# EasyEDA Pro project Photodetector_v2.eprj

# Schematic Schematic1
Board Name: Board1; Create Date: 2025-05-13; Page Name: P1; Project Name: Photodetector_v2; Schematic Name: Schematic1; Update Date: 2025-05-30; Company: EasyEDA.com; Page Size: A4; Version: V1.0
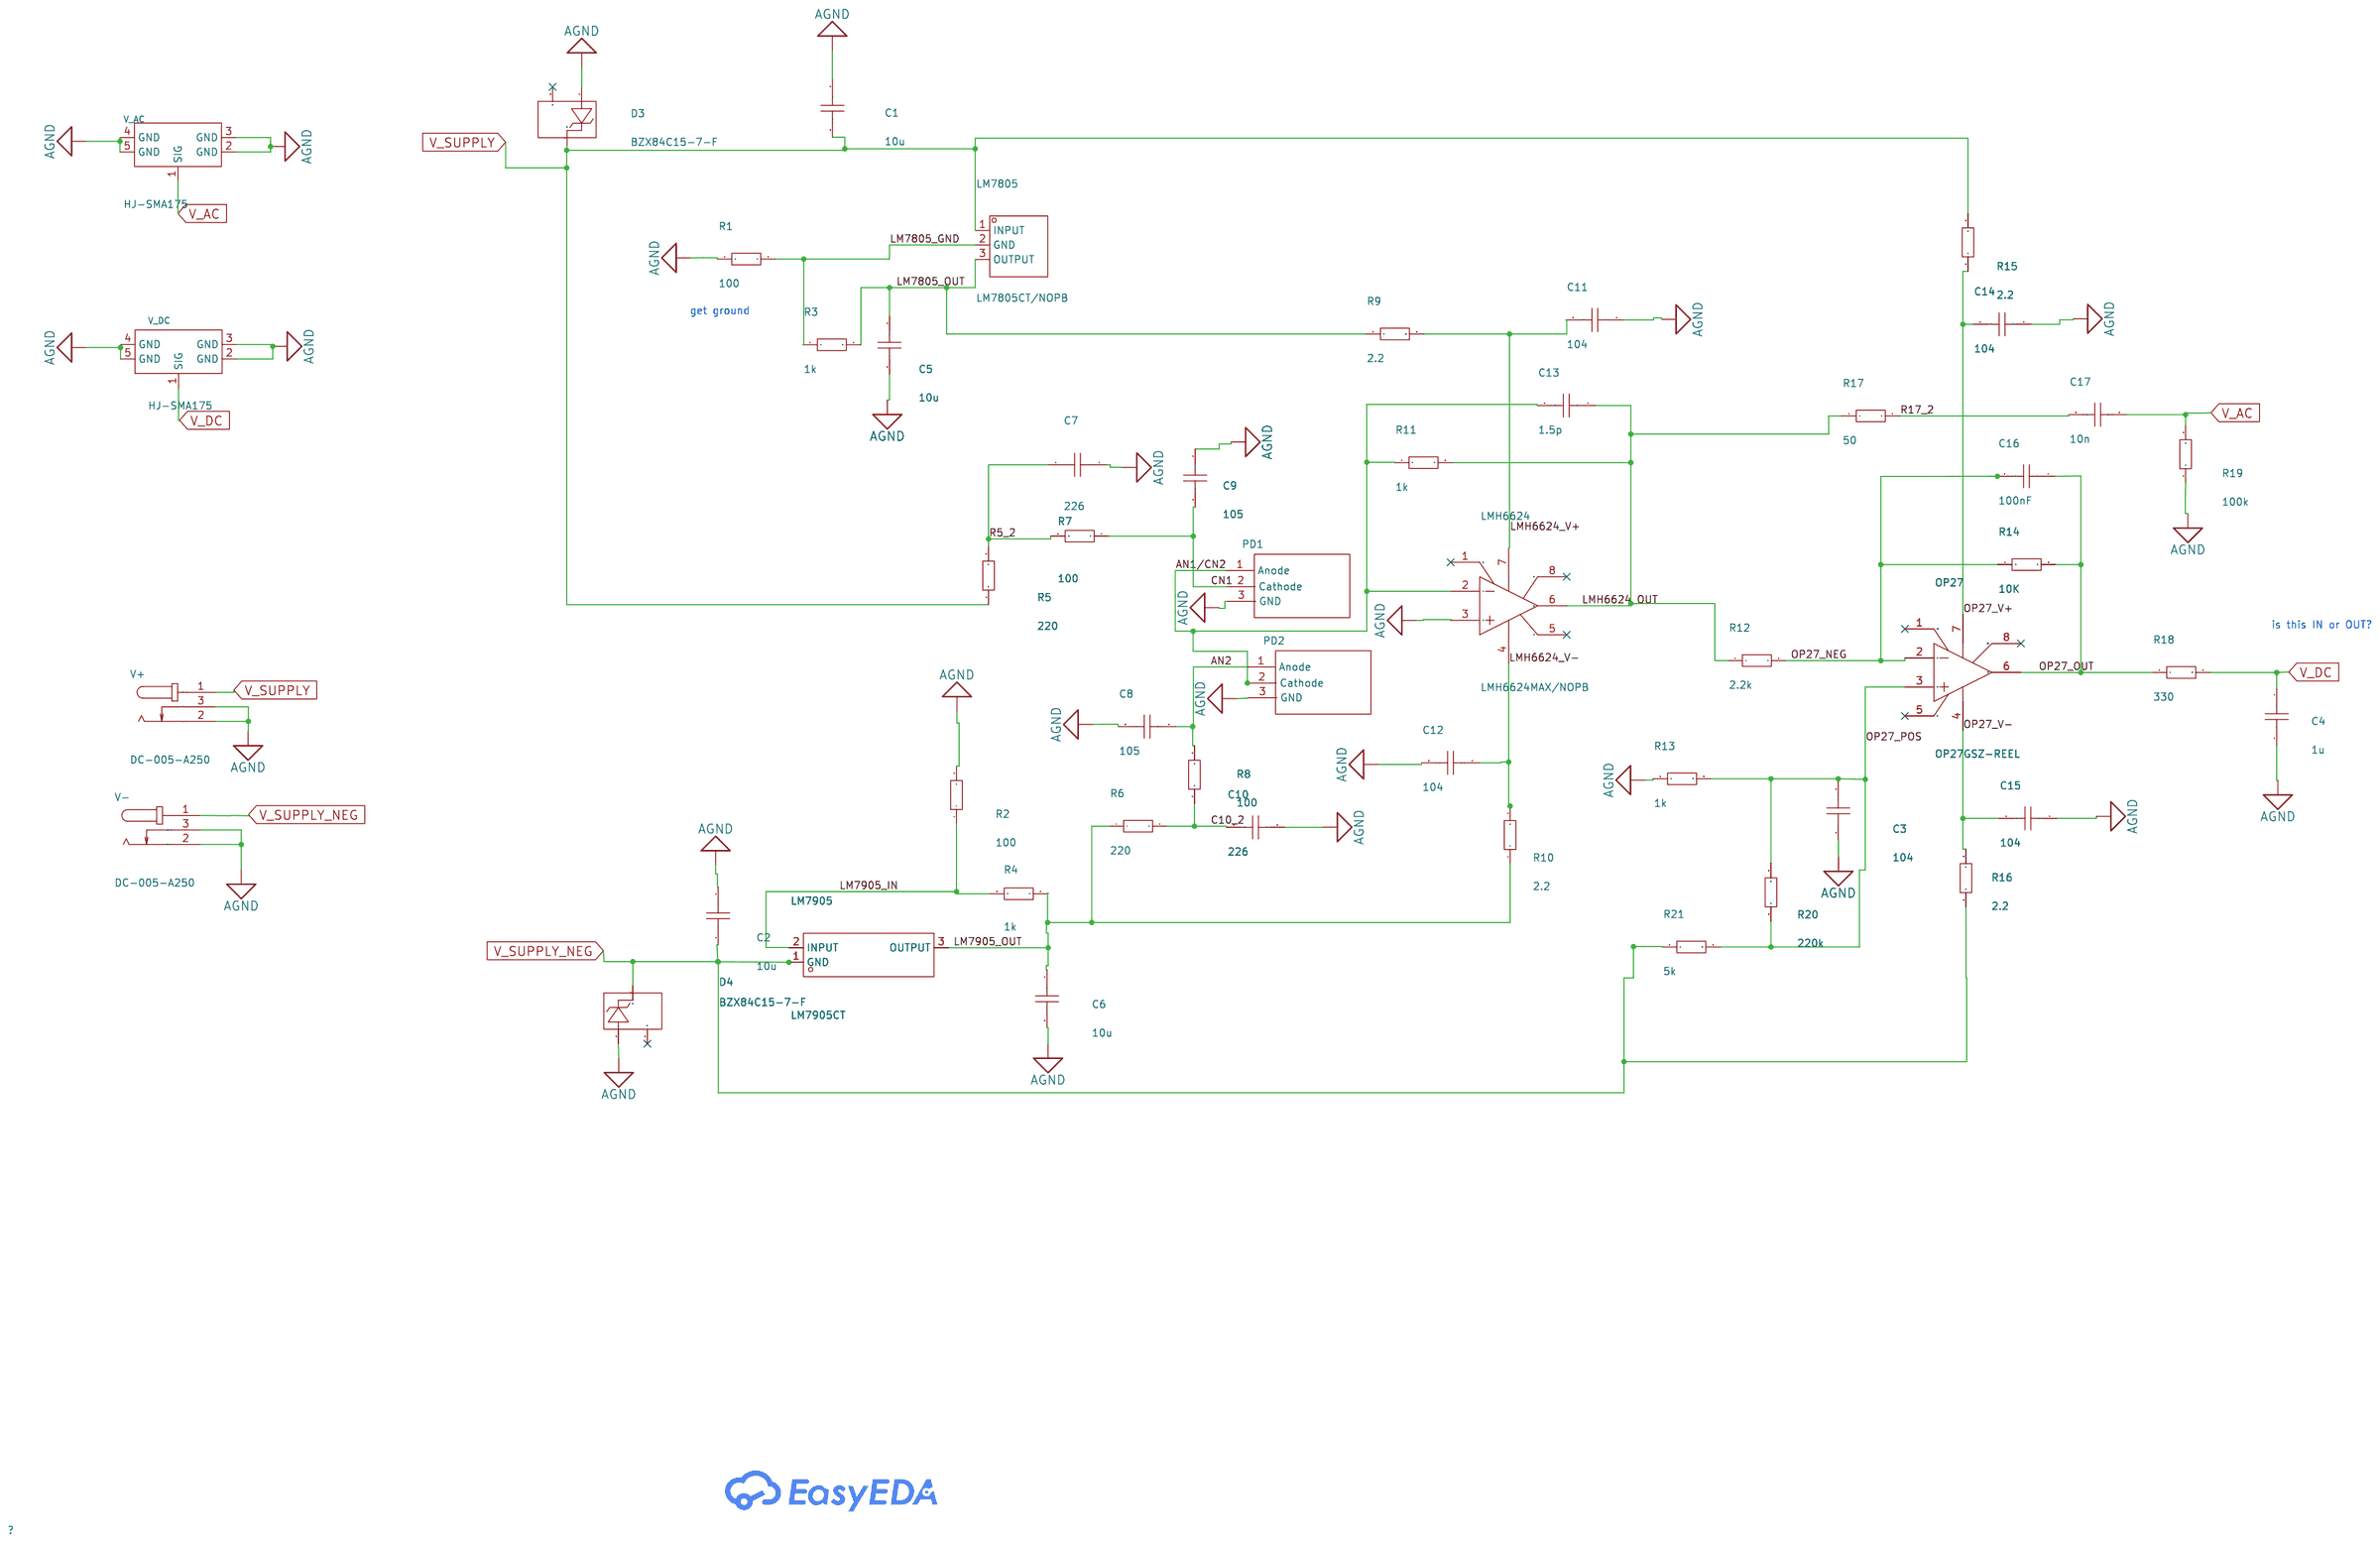
[diagram p0: schematic sheet]

## Parts
C1  10u  [C0603]
C2  10u  [C0603]
C3  104  [C0603]
C4  1u  [C0603]
C5  10u  [C0603]
C6  10u  [C0603]
C7  226  [C0603]
C8  105  [C0603]
C9  105  [C0603]
C10  226  [C0603]
C11  104  [C0603]
C12  104  [C0603]
C13  1.5p  [C0603]
C14  104  [C0603]
C15  104  [C0603]
C16  100nF  [C0603]
C17  10n  [C0603]
D3  BZX84C15-7-F  [SOT-23-3_L2.9-W1.3-P1.90-LS2.4-BR]
D4  BZX84C15-7-F  [SOT-23-3_L2.9-W1.3-P1.90-LS2.4-BR]
LM7805  LM7805CT/NOPB  [TO-220-3_L10.0-W4.5-P2.54-T]
LM7905  LM7905CT  [TO-220-3_L9.9-W4.5-P2.54-L]
LMH6624  LMH6624MAX/NOPB  [SOIC-8_L4.9-W3.9-P1.27-LS6.0-BL]
OP27  OP27GSZ-REEL  [SOIC-8_L4.9-W3.9-P1.27-LS6.0-BL]
PD1  -  [HQE Detector]
PD2  -  [HQE Detector]
R1  100  [R0603]
R2  100  [R0603]
R3  1k  [R0603]
R4  1k  [R0603]
R5  220  [R0603]
R6  220  [R0603]
R7  100  [R0603]
R8  100  [R0603]
R9  2.2  [R0603]
R10  2.2  [R0603]
R11  1k  [R0603]
R12  2.2k  [R0603]
R13  1k  [R0603]
R14  10K  [R0603]
R15  2.2  [R0603]
R16  2.2  [R0603]
R17  50  [R0603]
R18  330  [R0603]
R19  100k  [R0603]
R20  220k  [R0603]
R21  5k  [R0603]
V+  DC-005-A250  [DC-IN-TH_DC-005-A250]
V-  DC-005-A250  [DC-IN-TH_DC-005-A250]
V_AC  HJ-SMA175  [SMA-TH_HJ-SMA175]
V_DC  HJ-SMA175  [SMA-TH_HJ-SMA175]

## Library data of the parts
C1-C17 = CAP_0603: Supplier Footprint: 0603
D3 D4 = BZX84C15-7-F: Supplier Part: C500789; Manufacturer: DIODES(美台); Supplier Footprint: SOT-23; JLCPCB Part Class: Extended Part; Datasheet: https://atta.szlcsc.com/upload/public/pdf/source/20191127/C460825_8B7CE8DA99B73E2871EF5DDF3D9CE9A8.pdf; Supplier: LCSC; Diode Configuration: Single; Zener Voltage (Nom): 15V; Reverse Leakage Current (Ir): 100nA@10.5V; Zener Voltage (Range): 13.8V~15.6V; Power Dissipation: 300mW; Zener Impedance (Zzt): 30Ω; Tolerance: ±6%
LM7805 = LM7805CT/NOPB: LCSC Part Name: 1.5A、30V 线性稳压器; Supplier Part: C50931; Manufacturer: TI(德州仪器); Supplier Footprint: TO-220; JLCPCB Part Class: Extended Part; Datasheet: https://www.ti.com/cn/lit/gpn/lm7800; Supplier: LCSC; Output Type: Fixed; Maximum Input Voltage: 35V; Output Voltage: 5V; Output Current: 1A; Power Supply Rejection Ratio (PSRR): 80dB@(120Hz); Dropout Voltage: 2V@(1A); standby current: 6mA; Feature: 防静电保护；Short-Circuit  Protection；Thermal Protection(TSD)；Overcurrent Protection(OCP)；带使能; Operating Temperature: 0℃~+125℃; Output Polarity: Positive electrode; Number of Outputs: 1
LM7905 = LM7905CT_C7432217: Supplier Part: C7432217; Manufacturer: HGSEMI(华冠); Supplier Footprint: TO-220-3; JLCPCB Part Class: Extended Part; Datasheet: https://atta.szlcsc.com/upload/public/pdf/source/20231018/5BB71A5A92E7CAA6C954476BD60B4068.pdf; Supplier: LCSC; Output Type: Fixed; Maximum Input Voltage: 35V; Output Voltage: 5V; Output Current: 1.5A; Power Supply Rejection Ratio (PSRR): 60dB@(120Hz); Operating Temperature: -20℃~+125℃@(Ta); Output Polarity: Negative electrode; Number of Outputs: 1
LMH6624 = LMH6624MAX/NOPB: Supplier Part: C486023; Manufacturer: TI(德州仪器); Supplier Footprint: SOIC-8; JLCPCB Part Class: Extended Part; Datasheet: https://www.ti.com/cn/lit/gpn/lmh6624; Supplier: LCSC
OP27 = OP27GSZ-REEL: Supplier Part: C581242; Manufacturer: ADI(亚德诺); Supplier Footprint: SOIC-8; JLCPCB Part Class: Extended Part; Datasheet: https://atta.szlcsc.com/upload/public/pdf/source/20190807/C408903_306E85C5C164A1857E665ACBE0030C2C.pdf; Supplier: LCSC; Number of Circuits: 单路; Gain Bandwidth Product(GBP): 8MHz; Current - Input Bias(Ib): 15nA; Slew Rate(SR): 2.8V/us; Operating Temperature: -40℃~+85℃
PD1 PD2 = PD
R1-R21 = Res_0603: Supplier Footprint: 0603
V+ V- = DC-005-A250: LCSC Part Name: DC电源插座 内径:2.5mm 外径:6.3mm; Supplier Part: C720558; Manufacturer: XUNPU(讯普); Supplier Footprint: 插件; JLCPCB Part Class: Extended Part; Datasheet: https://atta.szlcsc.com/upload/public/pdf/source/20220428/F133011953B124341225656709BD6AA6.pdf; Supplier: LCSC; Connector Type: DC Power Receptacle; Mounting Style: Bend insert; Inside Contact Diameter: 2.5mm; Outside Contact Diameter: 6.3mm; Current Rating (Max): 3A; Voltage Rating (Max): 30V; Operating Temperature Range: -20℃~+70℃
V_AC V_DC = HJ-SMA175: LCSC Part Name: SMA 内孔 弯头 两件套; Supplier Part: C1509213; Manufacturer: 皇捷; Supplier Footprint: 插件; JLCPCB Part Class: Extended Part; Datasheet: https://atta.szlcsc.com/upload/public/pdf/source/20201224/C1509213_FEE037D2D73503198C916572913C3C1F.pdf; Supplier: LCSC; Connector Type: 板端; Interface Type: 内孔; Number of Ports: 1; Interface Diameter: 5.35mm; Interface Length/Height: 11mm; RF Series: SMA; Style: 弯头

## Nets
AGND: C2.1 C4.2 C5.2 C6.2 C7.1 C8.2 C9.1 C10.1 C11.1 C12.2 C14.1 C15.1 D4.1 LMH6624.3(IN+) PD1.3(GND) R1.1 R2.2 R13.1 R19.1 V+.2 V+.3 V-.2 V-.3 V_AC.2(GND) V_AC.3(GND) V_AC.4(GND) V_AC.5(GND) V_DC.2(GND) V_DC.3(GND) V_DC.4(GND) V_DC.5(GND)
AN1/CN2: C13.2 LMH6624.2(IN-) PD1.1(Anode) PD2.2(Cathode) R11.1
AN2: C8.1 PD2.1(Anode) R8.2
C10_2: C10.2 R6.2 R8.1
CN1: C9.2 PD1.2(Cathode) R7.1
LM7805_GND: LM7805.2(GND) R1.2 R3.1
LM7805_OUT: C5.1 LM7805.3(OUTPUT) R3.2 R9.1
LM7905_IN: R2.1 R4.2
LM7905_OUT: C6.1 LM7905.3(OUTPUT) R6.1 R10.1
LMH6624_OUT: C13.1 LMH6624.6(OUT) R11.2 R12.1 R17.1
LMH6624_V+: C11.2 LMH6624.7(V+) R9.2
LMH6624_V-: C12.1 LMH6624.4(V-) R10.2
OP27_NEG: C16.2 OP27.2(IN-) R12.2 R14.1
OP27_OUT: C16.1 OP27.6(OUT) R14.2
OP27_POS: C3.1 OP27.3(IN+) R13.2 R20.1 R20.2 R21.2
OP27_V+: C14.2 OP27.7(V+) R15.1
OP27_V-: C15.2 OP27.4(V-) R16.2
R5_2: C7.2 R5.2 R7.2
R17_2: C17.2 R17.2
V_AC: C17.1 R19.2 V_AC.1(SIG)
V_DC: C4.1 R18.2 V_DC.1(SIG)
V_SUPPLY: C1.2 D3.3 LM7805.1(INPUT) R5.1 R15.2 V+.1
V_SUPPLY_NEG: C2.2 D4.3 LM7905.1(GND) R21.1 V-.1

Not connected (* = marked no-connect by the designer): C1 1; C3 2; D3 1 2*; D4 2*; LM7905 2(INPUT); LMH6624 1(NC)* 5(NC)* 8(NC)*; OP27 1(VOS TRIM)* 5(NC)* 8(VOS TRIM)*; PD2 3(GND); R4 1; R16 1; R18 1

## Notes on the sheet
- get ground
- is this IN or OUT?

# Board PCB1
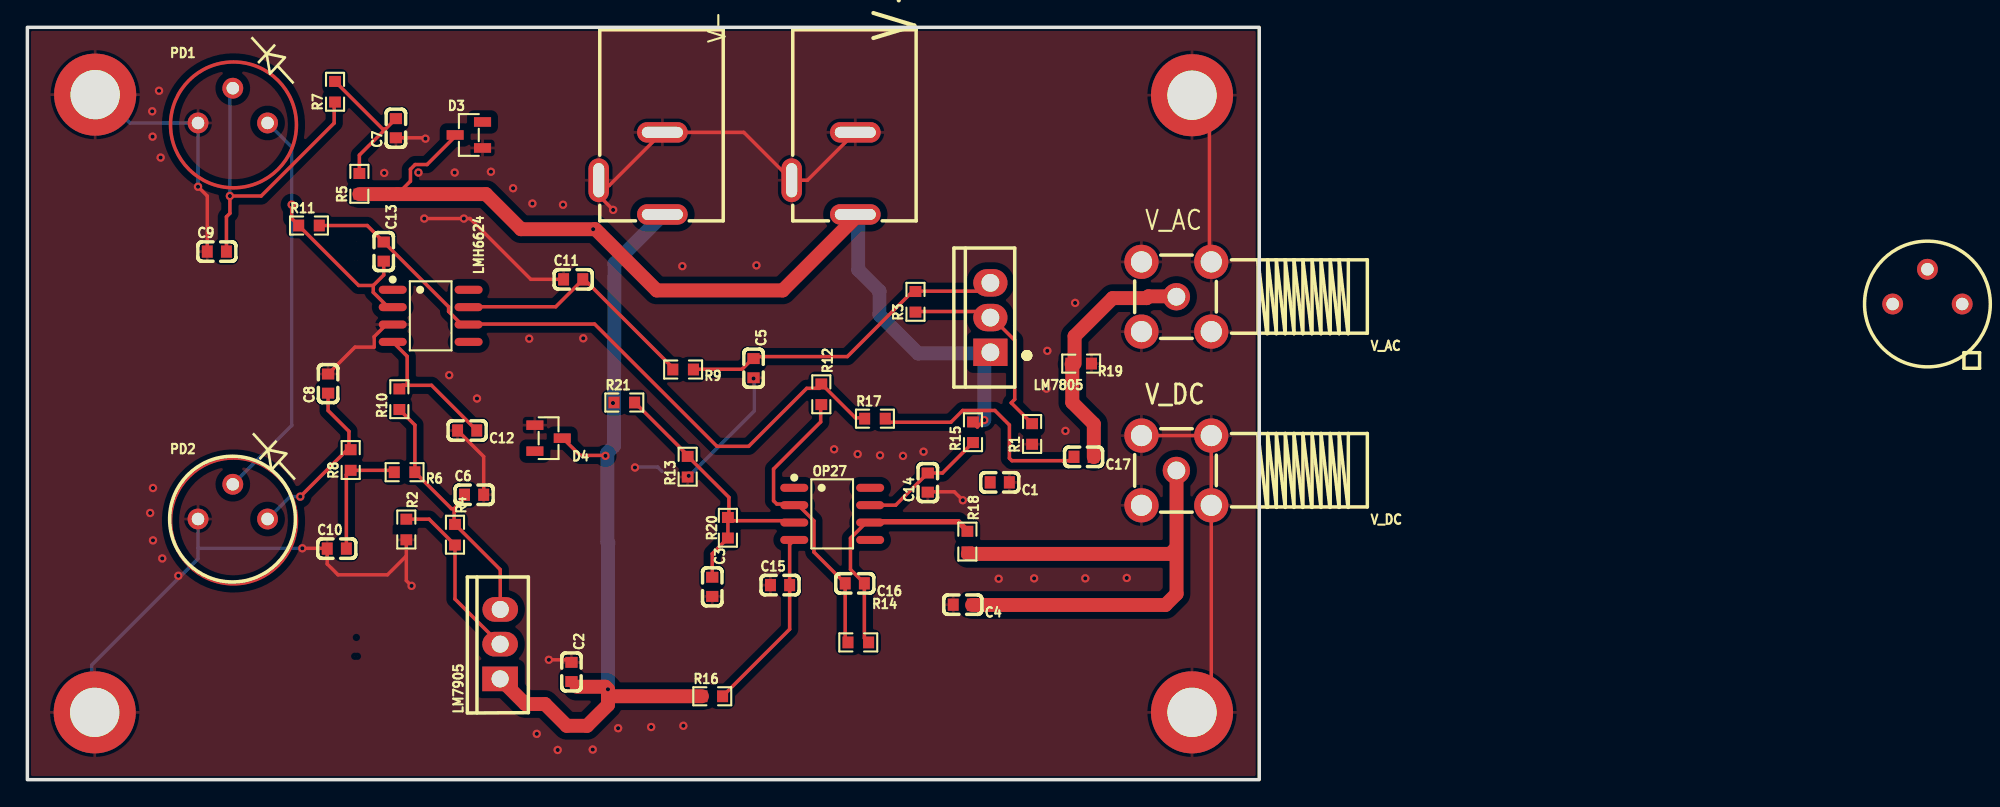
[diagram p1: board, top side]
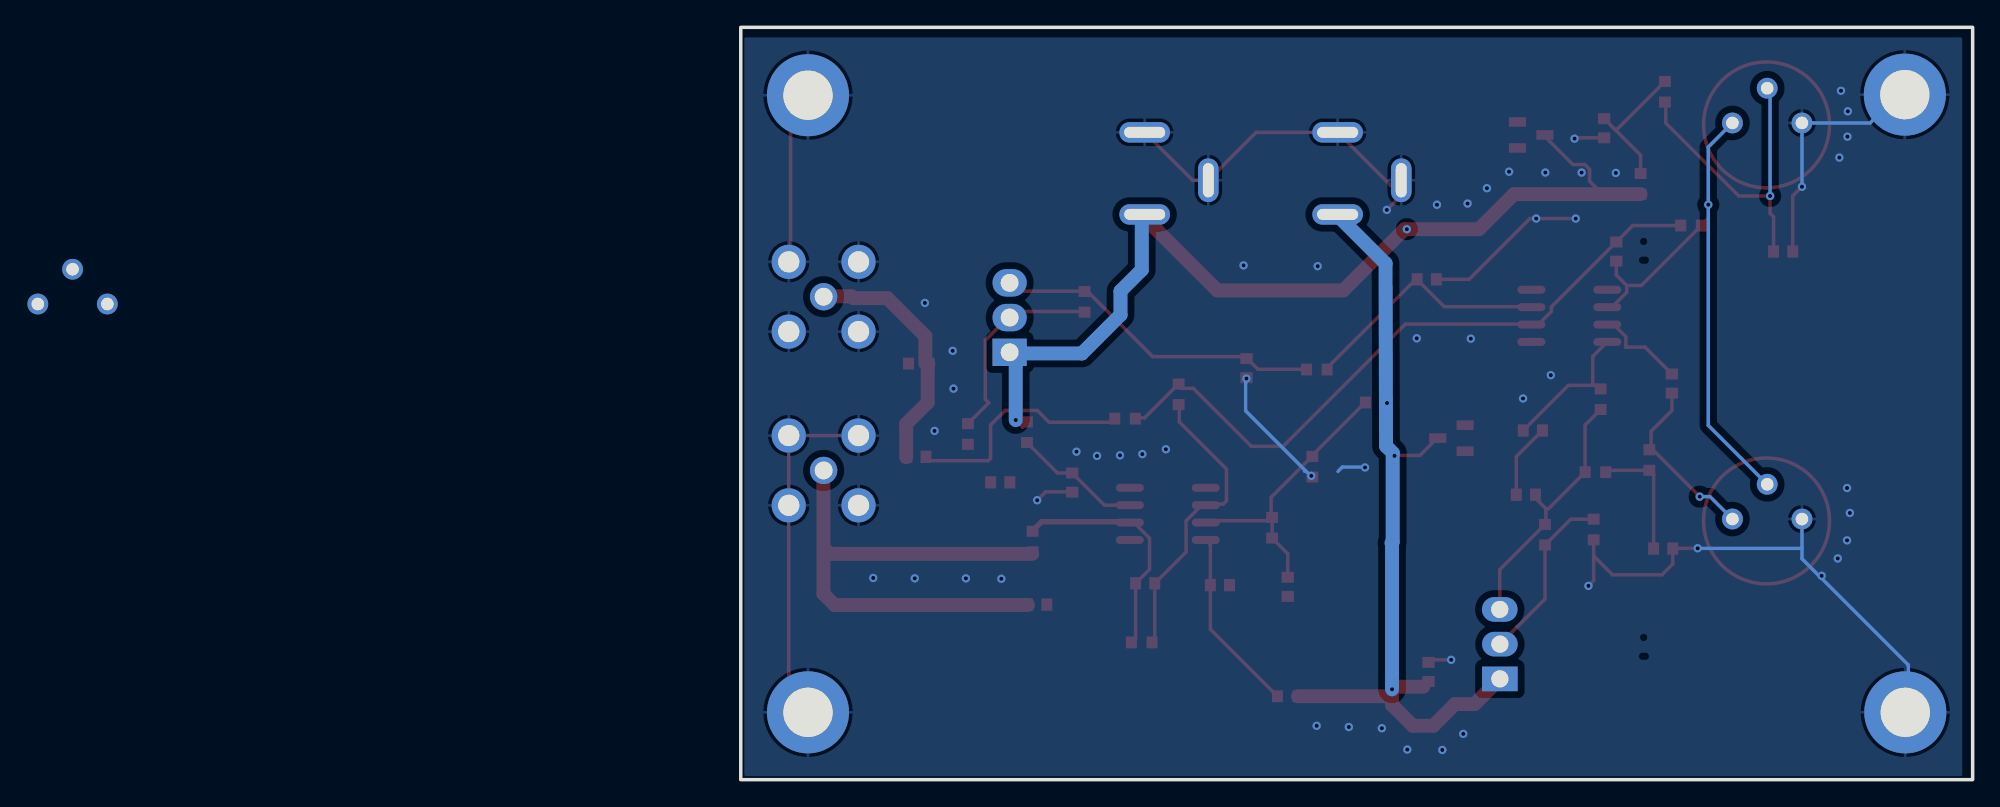
[diagram p2: board, bottom side, seen from below]

Outline 90 x 55 mm; copper layers: Top Layer, Bottom Layer. Coordinates in mm from the lower left corner of the outline.
Outline path: rectangle 0,55 90,0
Stack: Top Layer 0.035mm / Dielectric1 1.51mm FR4 er 4.5 / Bottom Layer 0.035mm

## Design rules (mm)
template: Custom Config
spacing copperThickness1oz (default): track to track 0.102, other pairs 0.152 to 0.3
spacing copperThickness2oz: track to track 0.203, other pairs 0.152 to 0.3
track width copperThickness1oz (default): min 0.127, default 0.254, max 2.54
track width copperThickness2oz: min 0.203, default 0.254, max 2.54
differential pair differentialPair (default): width min 0.127, default 0.254, max 2.54; gap min 0.152, default 0.152
via viaSize (default): diameter min 0.5, default 0.61, max 10; hole min 0.3, default 0.305, max 6.3

## Placement (name value [footprint] x y rotation side)
C1  10u  [C0603]  71.04 21.73 180 top
C2  10u  [C0603]  39.75 7.87 270 top
C3  104  [C0603]  50.04 14.1 270 top
C4  1u  [C0603]  68.34 12.79 180 top
C5  10u  [C0603]  53.05 30.08 270 top
C6  10u  [C0603]  32.64 20.83 0 top
C7  226  [C0603]  26.92 47.62 90 top
C8  105  [C0603]  21.97 28.96 90 top
C9  105  [C0603]  13.84 38.61 0 top
C10  226  [C0603]  22.61 16.89 0 top
C11  104  [C0603]  39.88 36.58 0 top
C12  104  [C0603]  32.13 25.53 180 top
C13  1.5p  [C0603]  26.03 38.61 270 top
C14  104  [C0603]  65.79 21.72 90 top
C15  104  [C0603]  54.99 14.22 0 top
C16  100nF  [C0603]  60.45 14.35 180 top
C17  10n  [C0603]  77.17 23.6 180 top
D3  BZX84C15-7-F  [SOT-23-3_L2.9-W1.3-P1.90-LS2.4-BR]  32.25 47.13 0 top
D4  BZX84C15-7-F  [SOT-23-3_L2.9-W1.3-P1.90-LS2.4-BR]  38.08 24.97 180 top
LM7805  LM7805CT/NOPB  [TO-220-3_L10.0-W4.5-P2.54-T]  70.36 33.78 180 top
LM7905  LM7905CT  [TO-220-3_L9.9-W4.5-P2.54-L]  34.54 9.91 90 top
LMH6624  LMH6624MAX/NOPB  [SOIC-8_L4.9-W3.9-P1.27-LS6.0-BL]  29.46 33.91 270 top
NOREF  -  [Pad_e1036]  85.09 4.92 0 top
NOREF#2  -  [Pad_e1034]  4.95 50.08 0 top
NOREF#3  -  [Pad_e1035]  85.09 50.04 0 top
NOREF#4  -  [Pad_e1032]  4.92 4.92 0 top
OP27  OP27GSZ-REEL  [SOIC-8_L4.9-W3.9-P1.27-LS6.0-BL]  58.8 19.43 270 top
PD1  -  [HQE Detector]  14.99 48.01 0 top
PD2  -  [IGHQEX100_FOOTPRINT]  138.82 34.77 0 top
PD2#2  -  [HQE Detector]  14.99 19.05 0 top
R1  100  [R0603]  73.41 25.27 90 top
R2  100  [R0603]  27.69 18.29 270 top
R3  1k  [R0603]  64.88 34.93 90 top
R4  1k  [R0603]  31.24 17.91 270 top
R5  220  [R0603]  24.26 43.56 90 top
R6  220  [R0603]  27.56 22.48 180 top
R7  100  [R0603]  22.48 50.29 90 top
R8  100  [R0603]  23.62 23.37 90 top
R9  2.2  [R0603]  47.91 29.98 180 top
R10  2.2  [R0603]  27.18 27.81 90 top
R11  1k  [R0603]  20.57 40.51 0 top
R12  2.2k  [R0603]  58.01 28.17 270 top
R13  1k  [R0603]  48.24 22.88 90 top
R14  10K  [R0603]  60.71 10.03 0 top
R15  2.2  [R0603]  69.09 25.4 90 top
R16  2.2  [R0603]  50.04 6.1 0 top
R17  50  [R0603]  61.92 26.39 0 top
R18  330  [R0603]  68.68 17.4 270 top
R19  100k  [R0603]  76.99 30.42 180 top
R20  220k  [R0603]  51.18 18.42 90 top
R21  5k  [R0603]  43.61 27.57 0 top
V+  DC-005-A250  [DC-IN-TH_DC-005-A250]  58.17 44.32 270 top
V-  DC-005-A250  [DC-IN-TH_DC-005-A250]  44.07 44.32 270 top
V_AC  HJ-SMA175  [SMA-TH_HJ-SMA175]  83.95 35.31 180 top
V_DC  HJ-SMA175  [SMA-TH_HJ-SMA175]  83.95 22.61 180 top

## Footprints (pads in the part's own frame, mm; a bottom-side part is the same pattern mirrored in y, then rotated)
C0603
  rect 0.8x0.9 smd: 1(-0.7,0) 2(0.7,0)
DC-IN-TH_DC-005-A250
  oval 1.5x3.7 hole 0.8x3: 1(3,2.325) 2(-3,2.325)
  oval 3.2x1.5 hole 2.5x0.8: 3(0.5,-2.325)
HQE Detector
  round 1.524 hole 0.914: 1(2.562,0.004) 2(0.022,2.544) 3(-2.518,0.004)
IGHQEX100_FOOTPRINT
  round 1.524 hole 0.914: 1(2.54,0) 2(0,2.54) 3(-2.54,0)
Pad_e1032
  round 6 hole 3.6: 1(0,0)
Pad_e1034
  round 6 hole 3.6: 1(0,0)
Pad_e1035
  round 6 hole 3.6: 2(0,0)
Pad_e1036
  round 6 hole 3.6: 3(0,0)
R0603
  rect 0.806x0.864 smd: 1(-0.753,0) 2(0.753,0)
SMA-TH_HJ-SMA175
  round 2 hole 1.3: 1(0,0)
  round 2.5 hole 1.55: 2(-2.55,2.55) 3(-2.55,-2.55) 4(2.55,-2.55) 5(2.55,2.55)
SOIC-8_L4.9-W3.9-P1.27-LS6.0-BL
  oval 0.588x2.045 smd: 1(-1.905,-2.772) 2(-0.635,-2.772) 3(0.635,-2.772) 4(1.905,-2.772) 5(1.905,2.772) 6(0.635,2.772) 7(-0.635,2.772) 8(-1.905,2.772)
SOT-23-3_L2.9-W1.3-P1.90-LS2.4-BR
  rect 1.25x0.7 smd: 1(1,-0.95) 2(1,0.95) 3(-1,0)
TO-220-3_L9.9-W4.5-P2.54-L
  rect 1.8x2.6 hole 1.25: 1(-2.54,0.005)
  oval 1.8x2.6 hole 1.25: 2(0,0.005) 3(2.54,-0.005)
TO-220-3_L10.0-W4.5-P2.54-T
  rect 2.5x2 hole 1.3: 1(0,2.54)
  oval 2.5x2 hole 1.3: 2(0,0) 3(0,-2.54)

## Nets
AGND: C1.1 C2.1 C3.2 C4.2 C5.2 C6.2 C7.1 C8.2 C9.1 C10.1 C11.1 C12.2 C14.1 C15.1 D3.1 D4.1 LMH6624.3 NOREF.3 NOREF#2.1 NOREF#3.2 NOREF#4.1 PD1.3 PD2#2.3 R1.1 R2.2 R13.1 R19.1 V+.2 V+.3 V-.2 V-.3 V_AC.2 V_AC.3 V_AC.4 V_AC.5 V_DC.2 V_DC.3 V_DC.4 V_DC.5
GND: PD2.3
AN1/CN2: C13.2 LMH6624.2 PD1.1 PD2#2.2 R11.1
AN2: C8.1 PD2#2.1 R8.2
C10_2: C10.2 R6.2 R8.1
CN1: C9.2 PD1.2 R7.1
LM7805_GND: LM7805.2 R1.2 R3.1
LM7805_OUT: C5.1 LM7805.3 R3.2 R9.1
LM7905_IN: LM7905.2 R2.1 R4.2
LM7905_OUT: C6.1 LM7905.3 R4.1 R6.1 R10.1
LMH6624_OUT: C13.1 LMH6624.6 R11.2 R12.1 R17.1
LMH6624_V+: C11.2 LMH6624.7 R9.2
LMH6624_V-: C12.1 LMH6624.4 R10.2
OP27_NEG: C16.2 OP27.2 R12.2 R14.1
OP27_OUT: C16.1 OP27.6 R14.2 R18.1
OP27_POS: C3.1 OP27.3 R13.2 R20.1 R20.2 R21.2
OP27_V+: C14.2 OP27.7 R15.1
OP27_V-: C15.2 OP27.4 R16.2
PD2_AND: PD2.1
PD2_CAT: PD2.2
R5_2: C7.2 R5.2 R7.2
R17_2: C17.2 R17.2
V_AC: C17.1 R19.2 V_AC.1
V_DC: C4.1 R18.2 V_DC.1
V_SUPPLY: C1.2 D3.3 LM7805.1 R5.1 R15.2 V+.1
V_SUPPLY_NEG: C2.2 D4.3 LM7905.1 R16.1 R21.1 V-.1

Pads without a net: D3 2; D4 2; LMH6624 1 5 8; OP27 1 5 8

## Via types
v1: diameter 0.61, hole 0.305, Top Layer to Bottom Layer, 61 vias

## Routing (per net, layer and track width the routed paths; a pad name or vN(x,y) marks a point on that pad's centre or on a via; arc(x,y) is an arc through that point)
AGND: length 165.6
  Top Layer w0.254: 27.69,16.36 26.31,14.98 22.69,14.98 21.91,15.77 C10.1 21.88,16.91 v1(20.09,16.91) ; 27.69,16.36 R2.2 ; 27.69,16.36 27.69,14.55 v1(28.07,14.17) ; 48.22,22.11 48.24,22.13 ; C11.1 36.78,36.58 32.34,41.02 v1(31.89,41.02) v1(29,41.02) ; v1(48.32,22.21) 48.25,22.28 ; V_DC.4 V_DC.3 V_DC.2 86.5,5.34 85.6,4.44 ; C7.1 29.02,46.92 v1(29.08,46.86) ; v1(12.47,43.35) 13.14,42.67 C9.1 ; C2.1 39.56,8.76 v1(38.1,8.76) ; LMH6624.3 26.22,33.27 25.33,32.39 25.33,31.62 23.94,31.62 C8.2 ; 68.29,20.48 67.73,21.05 65.72,21.05 ; 85.6,51.44 86.36,50.67 86.36,37.85 V_AC.3 ; C6.2 33.34,23.62 C12.2 ; V+.2 56.99,43.82 V+.3 52.34,47.32 V-.2 42.5,43.43 41.97,43.43 41.97,43.59 V-.3 41.74,42.71 v1(42.8,41.66)
  Bottom Layer w0.254: 53.11,29.29 53.11,26.96 48.73,22.58 ; 48.73,22.56 48.83,22.56 ; 4.83,50.67 7.49,48.01 PD1.3 v1(12.47,43.35) ; v1(48.32,22.21) 48.31,22.2 48.72,22.56 ; 46.37,22.53 46.05,22.85 44.34,22.85 ; 12.47,16.91 PD2#2.3 ; 12.47,16.91 v1(20.09,16.91) ; 12.47,16.91 12.47,16.15 4.7,8.38 4.7,4.57 ; 53.11,29.29 53.12,29.29
  vias: v1(8.97,19.5) v1(9.12,48.86) v1(9.15,47.01) v1(9.18,21.32) v1(9.18,17.5) v1(9.62,50.36) v1(9.74,45.48) v1(9.85,16.17) v1(11.03,14.91) v1(26.07,44.36) v1(28.57,44.39) v1(30.82,29.57) v1(31.22,44.39) v1(32.85,27.87) v1(33.87,44.44) v1(35.49,43.24) v1(36.66,32.24) v1(36.9,42.12) v1(37.22,3.35) v1(38.75,2.17) v1(39.14,42.03) v1(40.61,32.27) v1(41.31,2.2) v1(43.16,3.76) v1(44.39,22.82) v1(45.57,3.85) v1(47.85,37.54) v1(47.93,3.94) v1(53.06,29.33) v1(53.27,37.6) v1(58.94,24.15) v1(60.66,23.8) v1(62.3,23.71) v1(63.97,23.67) v1(65.47,23.98) v1(68.35,20.43) v1(70.96,14.69) v1(73.55,14.72) v1(74.52,31.35) v1(74.46,28.59) v1(75.84,25.5) v1(76.55,34.85) v1(77.29,14.72) v1(80.32,14.75)
AN1/CN2: length 42.4
  Top Layer w0.254: 25.27,36.13 25.27,35.62 26.29,34.61 26.63,34.61 LMH6624.2 ; 25.27,36.13 24.2,36.13 R11.1 19.31,41.02 v1(19.31,42.04) ; 25.27,36.13 26.03,36.89 C13.2
  Bottom Layer w0.254: PD1.1 19.31,46.25 v1(19.31,42.04) 19.31,25.9 PD2#2.2
AN2: length 12.9
  Top Layer w0.254: 23.5,24.25 v1(19.94,20.69) ; 23.5,24.25 R8.2 ; 23.5,24.25 23.5,25.46 21.97,26.99 C8.1
  Bottom Layer w0.254: PD2#2.1 19.19,20.69 v1(19.94,20.69)
C10_2: length 9.1
  Top Layer w0.254: R6.2 26.67,22.61 R8.1 23.31,22.3 C10.2
CN1: length 23.5
  Top Layer w0.254: R7.1 22.42,49.48 22.42,48.01 17.08,42.67 v1(14.8,42.67) 14.8,41.4 14.54,41.15 C9.2
  Bottom Layer w0.254: PD1.2 14.8,50.34 v1(14.8,42.67)
LM7805_GND: length 14.7
  Top Layer w0.254: 70.48,33.78 72.14,32.12 72.14,27.8 71.88,27.55 R1.2 ; 70.27,33.83 69.87,34.23 64.93,34.23
LM7805_OUT: length 24.3
  Top Layer w0.254: 53.05,30.84 52.21,30 48.69,30 ; 70.43,36.47 69.68,35.71 64.9,35.71 64.96,35.78 ; 64.8,35.83 59.9,30.93 53.13,30.93
LM7905_IN: length 13
  Top Layer w0.254: LM7905.2 31.24,13.2 R4.2 29.35,19.04 R2.1
LM7905_OUT: length 19.1
  Top Layer w0.254: 31.18,19.81 31.18,18.73 R4.1 34.55,15.35 LM7905.3 ; 31.18,19.81 30.98,19.81 R6.1 28.31,25.93 R10.1 ; 31.18,19.81 31.94,20.57 C6.1
LMH6624_OUT: length 49.4
  Top Layer w0.254: 61.16,26.45 60.5,26.45 58,28.95 ; R11.2 24.83,40.51 C13.1 30.77,34.57 30.77,34.23 31.73,33.27 32.14,33.27 ; 58.13,28.81 58.05,28.81 57.85,28.61 56.94,28.61 52.7,24.37 50.38,24.37 41.44,33.31 32.5,33.31
LMH6624_V+: length 18.6
  Top Layer w0.254: 40.63,36.61 38.6,34.57 32.22,34.57 ; 40.65,36.61 47.18,30.08 47.18,29.93
LMH6624_V-: length 10.7
  Top Layer w0.254: R10.2 27.44,28.83 27.75,28.83 ; 27.75,28.83 29.53,28.83 C12.1 ; 27.75,28.83 27.75,30.94 LMH6624.4
OP27_NEG: length 21.5
  Top Layer w0.254: R14.1 59.75,10.23 C16.2 57.47,16.64 57.47,18.92 56.41,19.98 ; 55.99,20.13 55.97,20.15 54.75,20.15 54.52,20.39 54.52,22.71 57.96,26.15 57.96,27.43
OP27_OUT: length 17.5
  Top Layer w0.254: OP27.6 61.28,18.8 60.14,17.65 60.14,15.37 C16.1 61.15,10.34 R14.2
  Top Layer w0.4: 61.6,18.85 68.02,18.85 68.72,18.15
OP27_POS: length 20.8
  Top Layer w0.254: C3.1 50.04,16.52 R20.1 51.18,18.93 55.89,18.93 OP27.3 ; 48.24,23.66 51.26,20.64 51.26,19.19 51.23,19.16 ; 44.31,27.65 48.25,23.7
OP27_V+: length 9.4
  Top Layer w0.254: OP27.7 63.44,20.07 C14.2 66.86,22.42 R15.1
OP27_V-: length 13.6
  Top Layer w0.254: OP27.4 55.69,17.19 C15.2 55.69,11 R16.2
R5_2: length 10.2
  Top Layer w0.254: 26.16,47.56 24.26,45.66 R5.2 ; 26.16,47.56 C7.2 ; 26.16,47.56 25.96,47.56 R7.2
R17_2: length 17.2
  Top Layer w0.254: 76.48,23.58 76.22,23.32 71.93,23.32 71.75,23.5 71.75,25.93 70.69,26.99 68.33,26.99 67.47,26.13 62.66,26.13
V_AC: length 18.1
  Top Layer w1.016: 76.51,30.41 76.51,32.42 79.29,35.2 81.78,35.2 81.91,35.33 83.91,35.33 ; 77.92,23.58 77.92,26 76.34,27.58 76.34,30.32 76.29,30.37
V_DC: length 39.7
  Top Layer w1.016: 68.71,16.5 83.5,16.5 83.89,16.9 ; 69.02,12.77 83.15,12.77 83.96,13.58 83.96,22.63
V_SUPPLY: length 70.7
  Top Layer w0.254: R15.2 69.09,26.1 69.4,25.78 v1(69.91,26.29) ; 31.29,47.06 29.2,44.97 28.33,44.97 27.99,44.63 27.99,43.76 27.02,42.79
  Top Layer w1.016: 60.58,41.16 55.18,35.77 45.98,35.77 41.49,40.26 ; v1(41.34,40.24) 36.07,40.24 33.5,42.81 27.04,42.81 ; 27.02,42.81 R5.1
  Bottom Layer w1.016: v1(69.91,26.29) 69.91,30.8 ; 70.17,31.05 LM7805.1 ; 70.06,31.16 65.08,31.16 62.25,33.98 62.25,35.72 60.7,37.27 60.7,41.24
V_SUPPLY_NEG: length 60.1
  Top Layer w0.254: 39.09,24.99 40.38,23.71 42.27,23.71
  Top Layer w1.016: 42.42,6.1 42.42,5.46 40.89,3.94 39.41,3.94 37.82,5.53 36.38,5.53 LM7905.1 ; 42.42,6.1 R16.1 ; 42.42,6.1 v1(42.42,6.6) 42.23,6.79 40.13,6.79
  Bottom Layer w1.016: 42.37,23.66 42.37,17.38 42.46,17.3 ; 46.41,41.26 42.89,37.74 42.86,24.39 42.35,23.88 ; v1(42.42,6.6) 42.42,17.23
  vias: v1(42.24,23.67) v1(42.78,27.53)

## Copper pours and planes (outline as drawn; the poured copper is in the pictures)
AGND on Top Layer: 0,55 90,55 90,0 0,0
AGND on Bottom Layer: 0.77,54.26 90.76,54.26 90.76,-0.74 0.77,-0.74

## Text on the board
Top Silkscreen Layer: V_AC | V_DC
